# EAGLE design BeeBeeAte-ESP32-V4 (EAGLE 9.6.2)

## Sheet 1 of 4: Power Supply
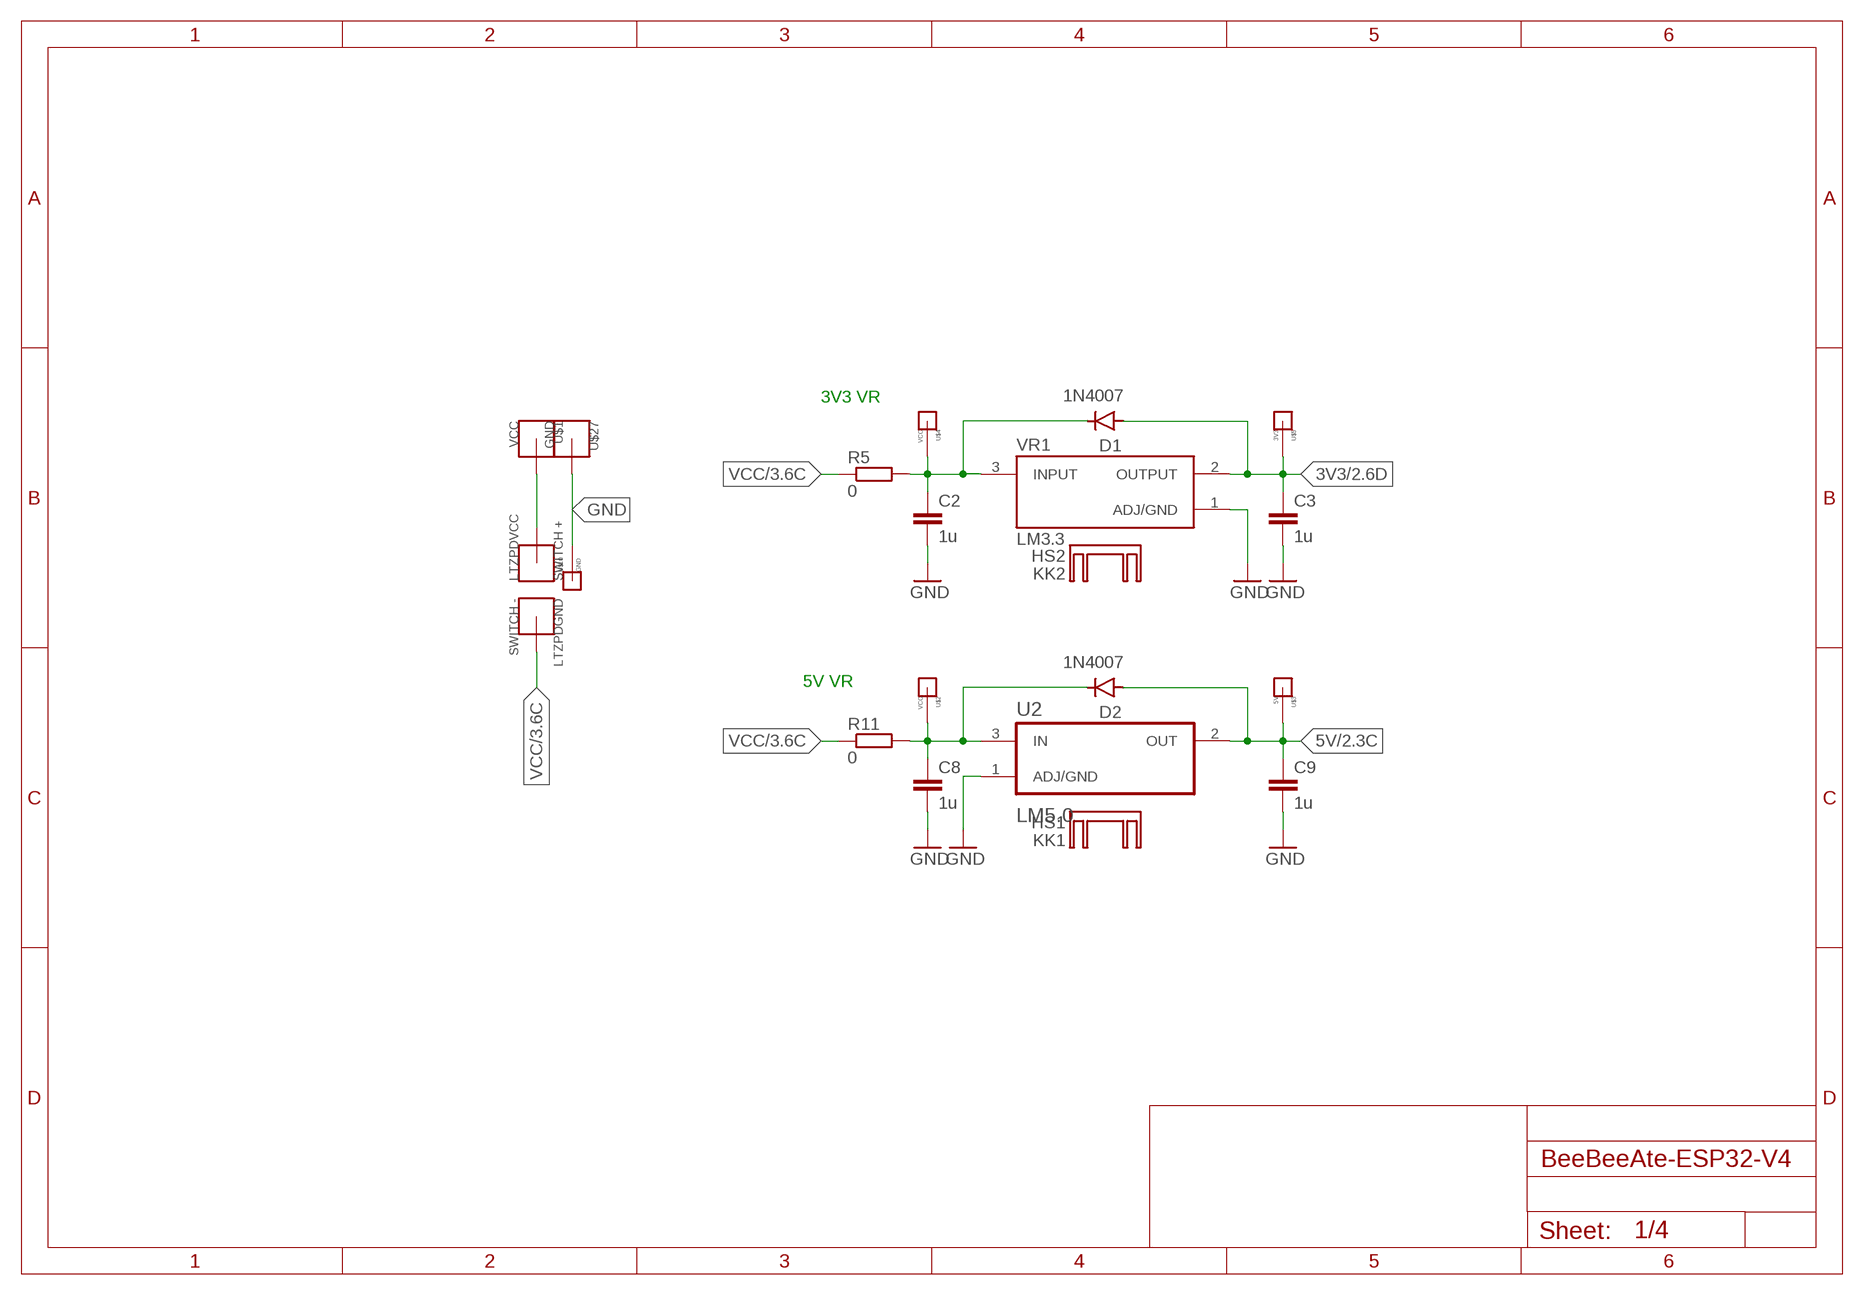
[diagram p0: schematic, sheet 1]

### Parts
C2  1u  C-EUC0805  [C0805]
C3  1u  C-EUC0805  [C0805]
C8  1u  C-EUC0805  [C0805]
C9  1u  C-EUC0805  [C0805]
D1  1N4007  [DO-41]
D2  1N4007  [DO-41]
KK1  HS1  SK95-2M3  [SK95-2M3]
KK2  HS2  SK95-2M3  [SK95-2M3]
LTZPDGND  SWITCH -  LITZENPAD  [LITZENPAD]
LTZPDVCC  SWITCH +  LITZENPAD  [LITZENPAD]
R5  0  R-EU_R0805  [R0805]
R11  0  R-EU_R0805  [R0805]
U2  LM5.0  LM1117T-5.0  [TO254P1054X470X1955-3]
U$1  VCC  LITZENPAD  [LITZENPAD]
U$2  VCC  MESSPAD  [MESSPAD]
U$3  5V  MESSPAD  [MESSPAD]
U$4  VCC  MESSPAD  [MESSPAD]
U$5  3V3  MESSPAD  [MESSPAD]
U$10  GND  MESSPAD  [MESSPAD]
U$27  GND  LITZENPAD  [LITZENPAD]
VR1  LM3.3  LM1117T-3.3/NOPB  [TO254P1054X470X1955-3]

### Nets
3V3: C3.1 D1.A U$5.MSP VR1.2(OUTPUT) ; also sheet 2,3,4
5V: C9.1 D2.A U2.2(OUT) U$3.MSP ; also sheet 2
GND: C2.2 C3.2 C8.2 C9.2 U2.1(ADJ/GND) U$10.MSP U$27.P$1 VR1.1(ADJ/GND) ; also sheet 2,3,4
N$4: C2.1 D1.C R5.2 U$4.MSP VR1.3(INPUT)
N$5: LTZPDVCC.P$1 U$1.P$1
N$8: C8.1 D2.C R11.2 U2.3(IN) U$2.MSP
VCC: LTZPDGND.P$1 R5.1 R11.1 ; also sheet 3

### Notes on the sheet
- 3V3 VR
- 5V VR

## Sheet 2 of 4: ESP32 und USB Modul
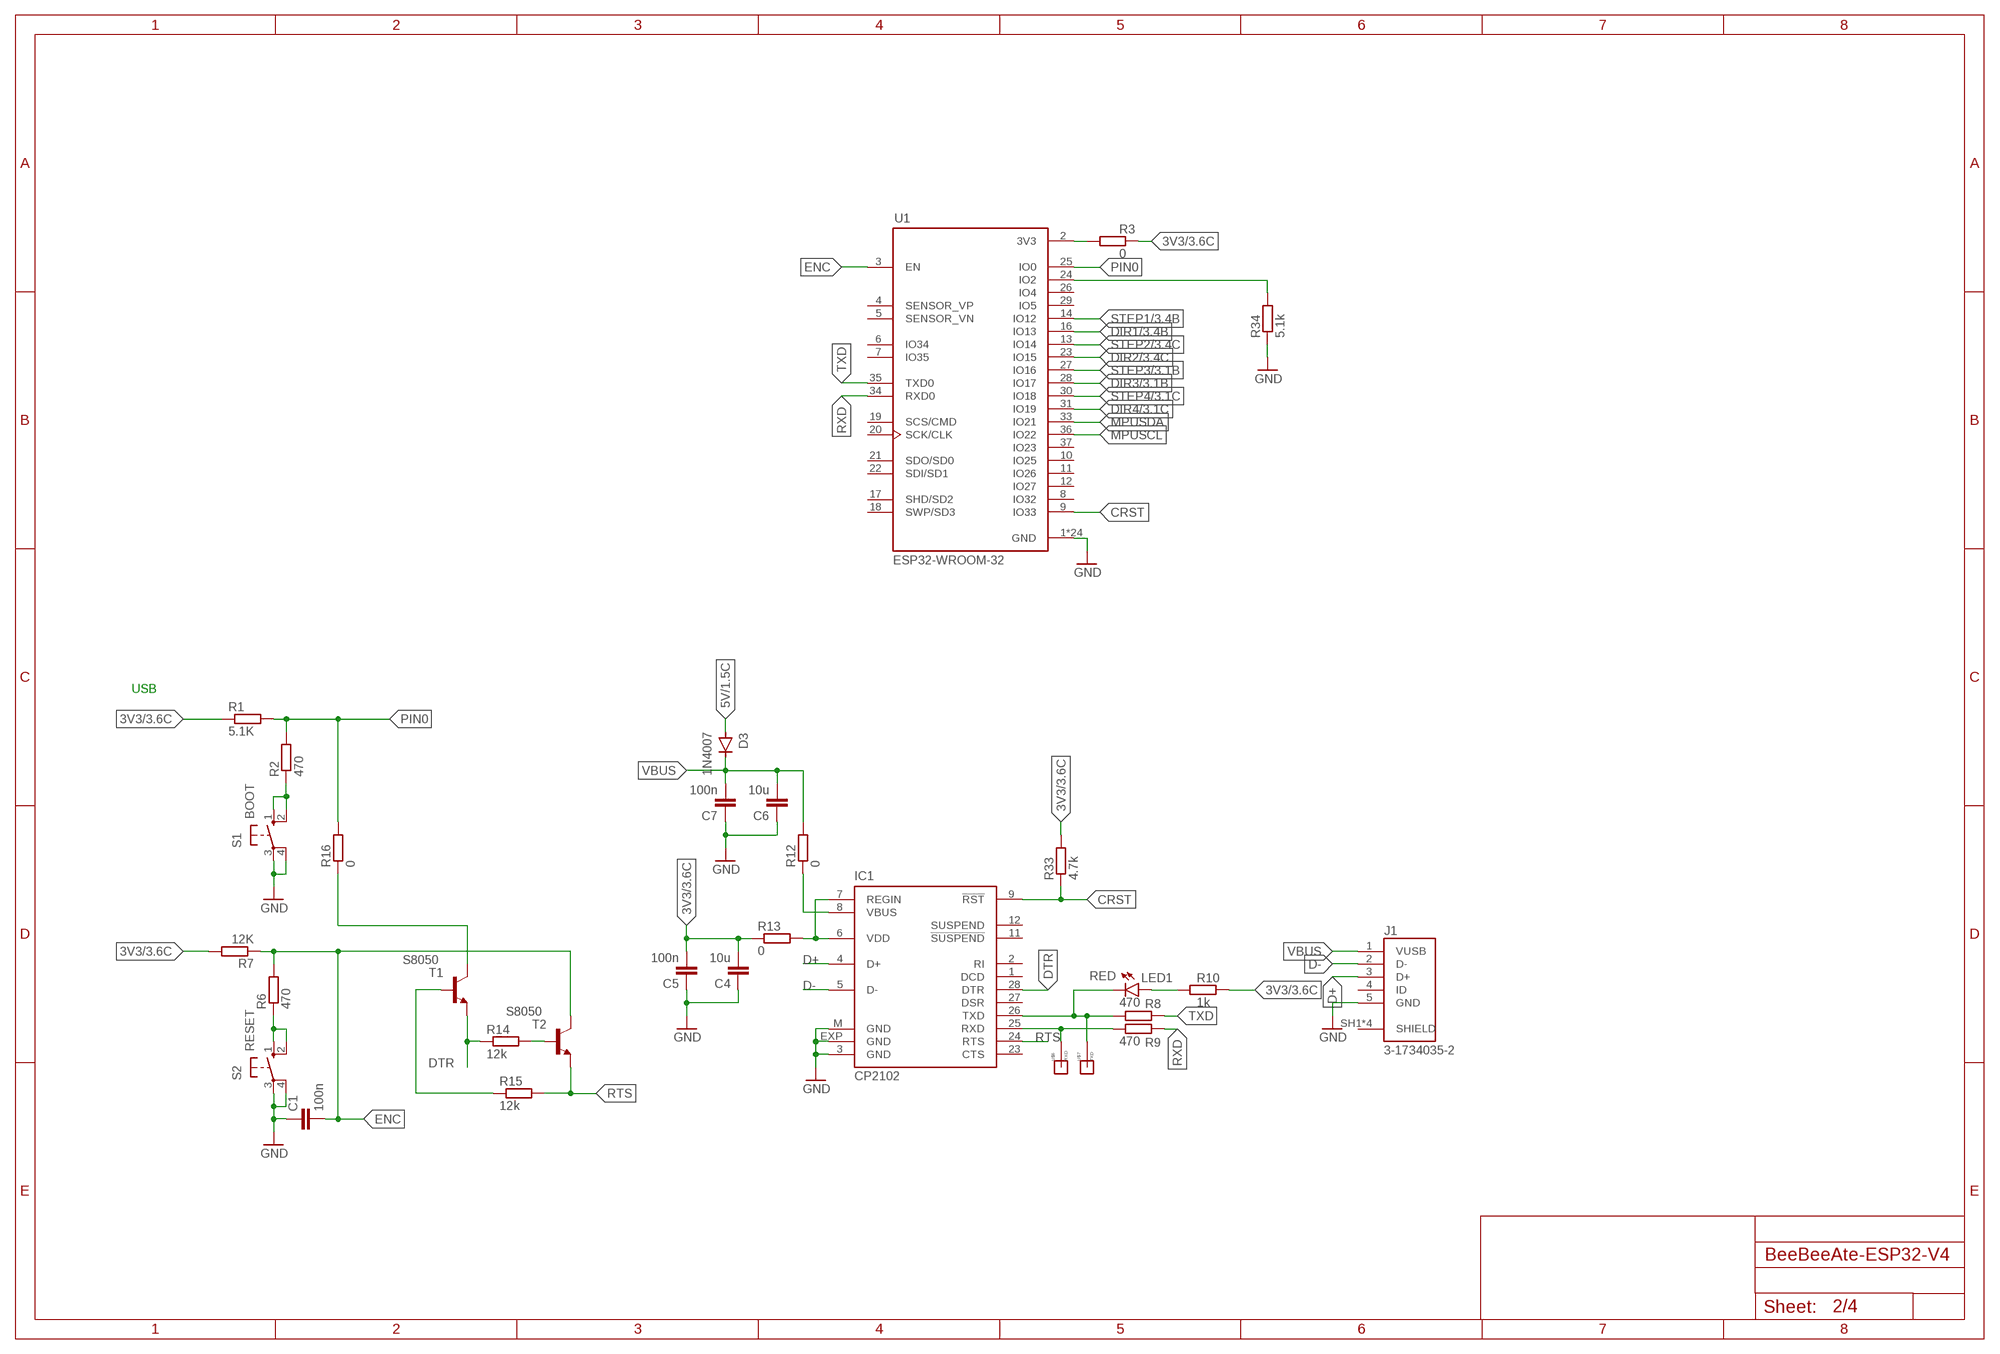
[diagram p1: schematic, sheet 2]

### Parts
C1  100n  C-EUC0805  [C0805]
C4  10u  C-EUC0805  [C0805]
C5  100n  C-EUC0805  [C0805]
C6  10u  C-EUC0805  [C0805]
C7  100n  C-EUC0805  [C0805]
D3  1N4007  [DO-41]
IC1  CP2102  [MLP28]
J1  3-1734035-2  [TE_3-1734035-2]
LED1  RED  LEDCHIP-LED0805  [CHIP-LED0805]
R1  5.1K  R-EU_R0805  [R0805]
R2  470  R-EU_R0805  [R0805]
R3  0  R-EU_R0805  [R0805]
R6  470  R-EU_R0805  [R0805]
R7  12K  R-EU_R0805  [R0805]
R8  470  R-EU_R0805  [R0805]
R9  470  R-EU_R0805  [R0805]
R10  1k  R-EU_R0805  [R0805]
R12  0  R-EU_R0805  [R0805]
R13  0  R-EU_R0805  [R0805]
R14  12k  R-EU_R0805  [R0805]
R15  12k  R-EU_R0805  [R0805]
R16  0  R-EU_R0805  [R0805]
R33  4.7k  R-EU_R0805  [R0805]
R34  5.1k  R-EU_R0805  [R0805]
S1  BOOT  10-XX  [B3F-10XX]
S2  RESET  10-XX  [B3F-10XX]
T1  S8050  BC808-NPN-SOT23-BEC  [SOT23-BEC]
T2  S8050  BC808-NPN-SOT23-BEC  [SOT23-BEC]
U1  ESP32-WROOM-32  [MODULE_ESP32-WROOM-32]
U$6  RXD  MESSPAD  [MESSPAD]
U$7  TXD  MESSPAD  [MESSPAD]

### Nets
3V3: C4.2 C5.2 R1.1 R3.2 R7.2 R10.2 R13.1 R33.2 ; also sheet 1,3,4
5V: D3.A ; also sheet 1
CRST: IC1.9(!RST) R33.1 U1.9(IO33)
D+: IC1.4(D+) J1.3(D+)
D-: IC1.5(D-) J1.2(D-)
DIR1: U1.16(IO13) ; also sheet 3
DIR2: U1.23(IO15) ; also sheet 3
DIR3: U1.28(IO17) ; also sheet 3
DIR4: U1.31(IO19) ; also sheet 3
DTR: IC1.28(DTR) R14.1 T1.E
ENC: C1.2 R6.2 R7.1 T2.C U1.3(EN)
GND: C1.1 C4.1 C5.1 C6.1 C7.1 IC1.3(GND) IC1.EXP(GND) IC1.M(GND) J1.5(GND) R34.1 S1.3(P) S1.4(P1) S2.3(P) S2.4(P1) U1.1(GND) U1.15(GND) U1.38(GND) U1.39_1(GND) U1.39_2(GND) U1.39_3(GND) U1.39_4(GND) U1.39_5(GND) U1.39_6(GND) U1.39_7(GND) U1.39_8(GND) U1.39_9(GND) U1.39_10(GND) U1.39_11(GND) U1.39_12(GND) U1.39_13(GND) U1.39_14(GND) U1.39_15(GND) U1.39_16(GND) U1.39_17(GND) U1.39_18(GND) U1.39_19(GND) U1.39_20(GND) U1.39_21(GND) ; also sheet 1,3,4
MPUSCL: U1.36(IO22) ; also sheet 4
MPUSDA: U1.33(IO21) ; also sheet 4
N$1: R2.1 S1.1(S) S1.2(S1)
N$2: R6.1 S2.1(S) S2.2(S1)
N$6: IC1.25(RXD) R9.1 U$6.MSP
N$7: LED1.A R10.1
N$9: IC1.26(TXD) LED1.C R8.1 U$7.MSP
N$10: IC1.6(VDD) IC1.7(REGIN) R13.2
N$11: IC1.8(VBUS) R12.1
N$12: R14.2 T2.B
N$14: R15.1 T1.B
N$25: R34.2 U1.24(IO2)
N$30: R3.1 U1.2(3V3)
PIN0: R1.2 R2.2 R16.2 U1.25(IO0)
PIN1: R16.1 T1.C
RTS: IC1.24(RTS) R15.2 T2.E
RXD: R9.2 U1.34(RXD0)
STEP1: U1.14(IO12) ; also sheet 3
STEP2: U1.13(IO14) ; also sheet 3
STEP3: U1.27(IO16) ; also sheet 3
STEP4: U1.30(IO18) ; also sheet 3
TXD: R8.2 U1.35(TXD0)
VBUS: C6.2 C7.2 D3.C J1.1(VUSB) R12.2
Unconnected: IC1.1(DCD) IC1.2(RI) IC1.11(!SUSPEND) IC1.12(SUSPEND) IC1.23(CTS) IC1.27(DSR) J1.4(ID) J1.SH1(SHIELD) J1.SH2(SHIELD) J1.SH3(SHIELD) J1.SH4(SHIELD) U1.4(SENSOR_VP) U1.5(SENSOR_VN) U1.6(IO34) U1.7(IO35) U1.8(IO32) U1.10(IO25) U1.11(IO26) U1.12(IO27) U1.17(SHD/SD2) U1.18(SWP/SD3) U1.19(SCS/CMD) U1.20(SCK/CLK) U1.21(SDO/SD0) U1.22(SDI/SD1) U1.26(IO4) U1.29(IO5) U1.37(IO23)

### Notes on the sheet
- USB

## Sheet 3 of 4: Treiber für Motoren
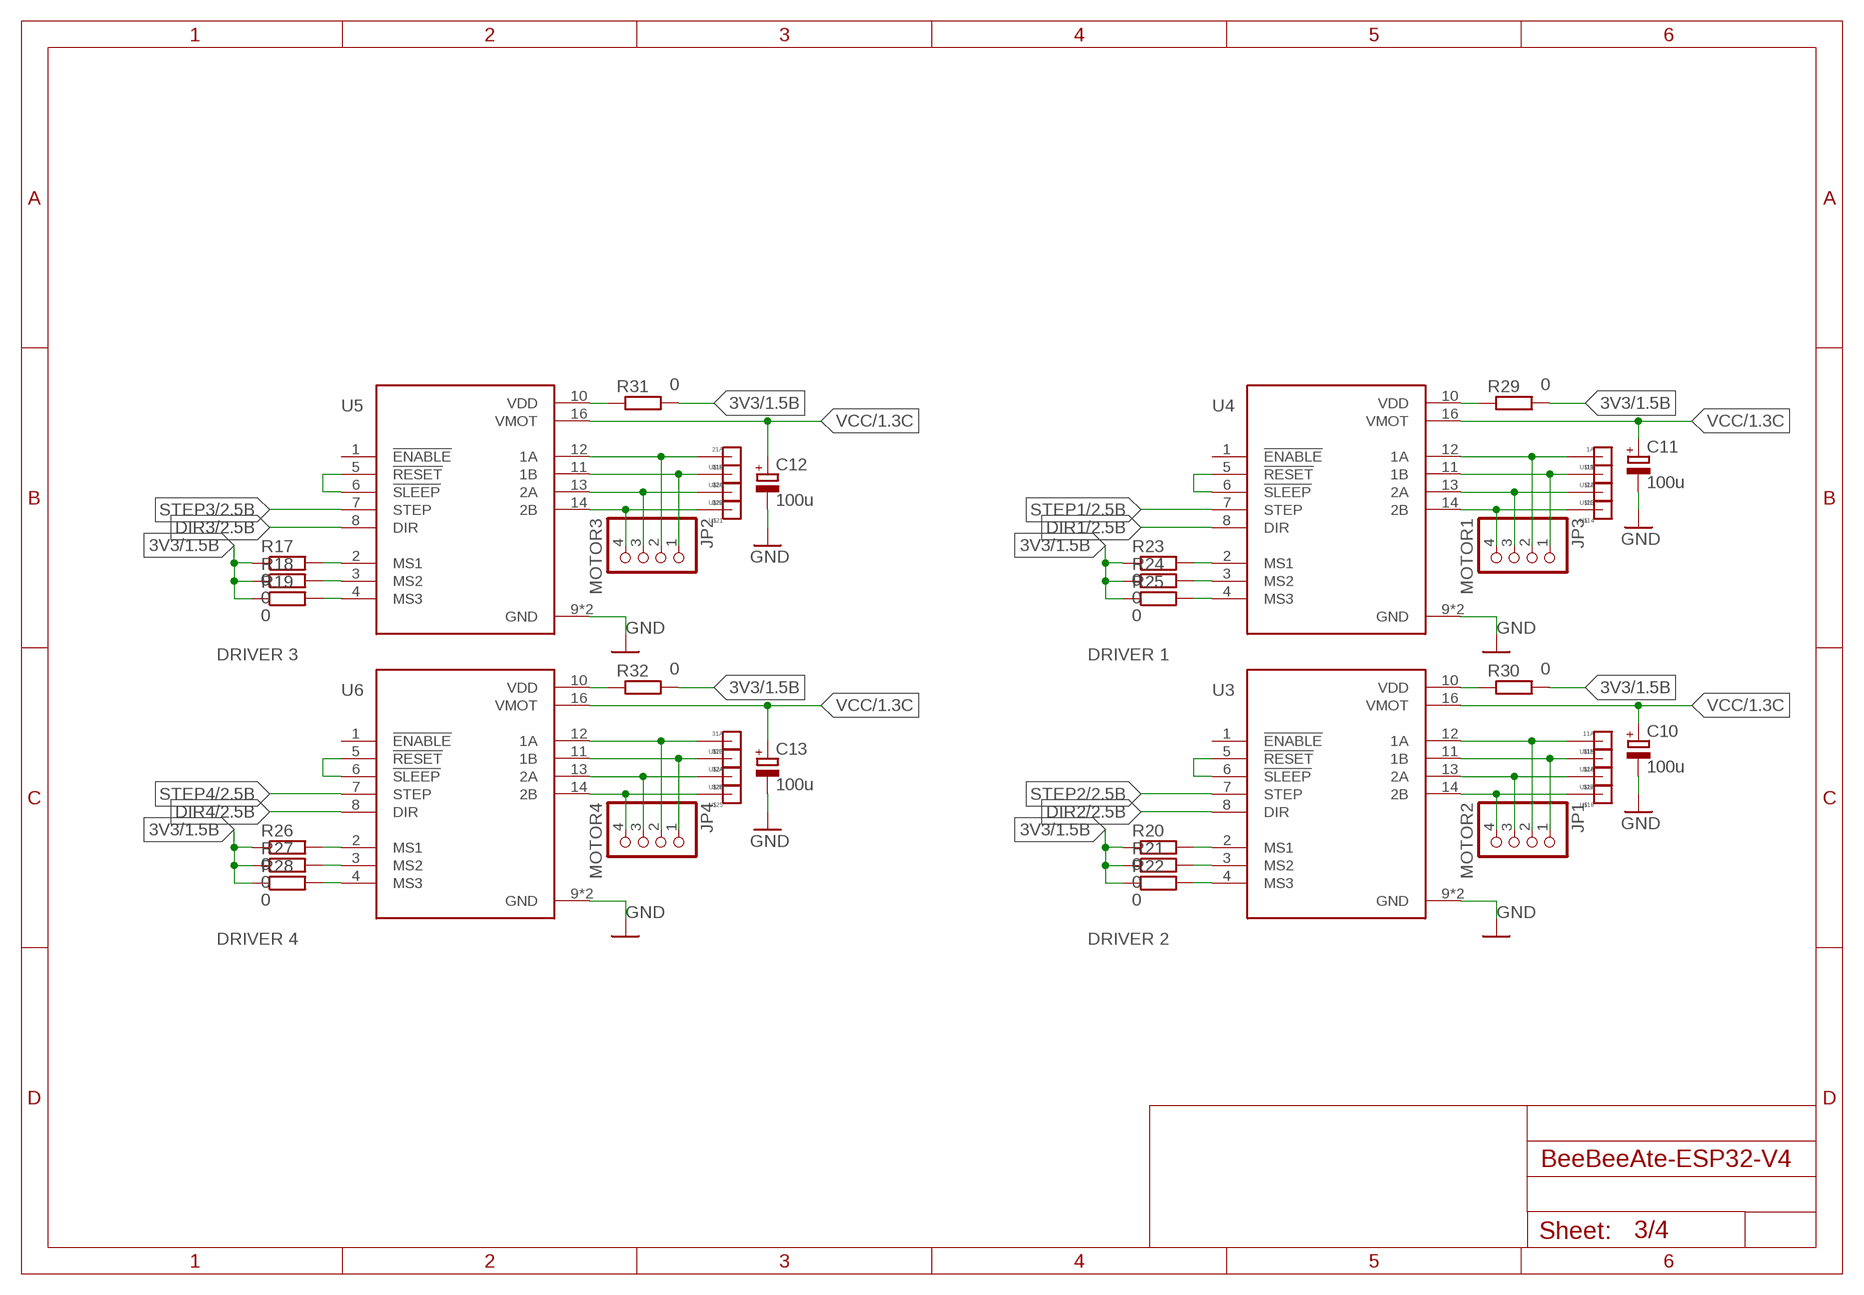
[diagram p2: schematic, sheet 3]

### Parts
C10  100u  CPOL-EU153CLV-0605  [153CLV-0605]
C11  100u  CPOL-EU153CLV-0605  [153CLV-0605]
C12  100u  CPOL-EU153CLV-0605  [153CLV-0605]
C13  100u  CPOL-EU153CLV-0605  [153CLV-0605]
JP1  MOTOR2  PINHD-1X4  [1X04]
JP2  MOTOR3  PINHD-1X4  [1X04]
JP3  MOTOR1  PINHD-1X4  [1X04]
JP4  MOTOR4  PINHD-1X4  [1X04]
R17  0  R-EU_R0805  [R0805]
R18  0  R-EU_R0805  [R0805]
R19  0  R-EU_R0805  [R0805]
R20  0  R-EU_R0805  [R0805]
R21  0  R-EU_R0805  [R0805]
R22  0  R-EU_R0805  [R0805]
R23  0  R-EU_R0805  [R0805]
R24  0  R-EU_R0805  [R0805]
R25  0  R-EU_R0805  [R0805]
R26  0  R-EU_R0805  [R0805]
R27  0  R-EU_R0805  [R0805]
R28  0  R-EU_R0805  [R0805]
R29  0  R-EU_R0805  [R0805]
R30  0  R-EU_R0805  [R0805]
R31  0  R-EU_R0805  [R0805]
R32  0  R-EU_R0805  [R0805]
U3  DRIVER 2  A4988_STEPPER_MOTOR_DRIVER_CARRIER  [MODULE_A4988_STEPPER_MOTOR_DRIVER_CARRIER]
U4  DRIVER 1  A4988_STEPPER_MOTOR_DRIVER_CARRIER  [MODULE_A4988_STEPPER_MOTOR_DRIVER_CARRIER]
U5  DRIVER 3  A4988_STEPPER_MOTOR_DRIVER_CARRIER  [MODULE_A4988_STEPPER_MOTOR_DRIVER_CARRIER]
U6  DRIVER 4  A4988_STEPPER_MOTOR_DRIVER_CARRIER  [MODULE_A4988_STEPPER_MOTOR_DRIVER_CARRIER]
U$11  1A  MESSPAD  [MESSPAD]
U$12  1B  MESSPAD  [MESSPAD]
U$13  2A  MESSPAD  [MESSPAD]
U$14  2B  MESSPAD  [MESSPAD]
U$15  11A  MESSPAD  [MESSPAD]
U$16  11B  MESSPAD  [MESSPAD]
U$17  12A  MESSPAD  [MESSPAD]
U$18  12B  MESSPAD  [MESSPAD]
U$19  21A  MESSPAD  [MESSPAD]
U$20  21B  MESSPAD  [MESSPAD]
U$21  22B  MESSPAD  [MESSPAD]
U$22  22A  MESSPAD  [MESSPAD]
U$23  31A  MESSPAD  [MESSPAD]
U$24  31B  MESSPAD  [MESSPAD]
U$25  32B  MESSPAD  [MESSPAD]
U$26  32A  MESSPAD  [MESSPAD]

### Nets
3V3: R17.1 R18.1 R19.1 R20.1 R21.1 R22.1 R23.1 R24.1 R25.1 R26.1 R27.1 R28.1 R29.2 R30.2 R31.2 R32.2 ; also sheet 1,2,4
DIR1: U4.8(DIR) ; also sheet 2
DIR2: U3.8(DIR) ; also sheet 2
DIR3: U5.8(DIR) ; also sheet 2
DIR4: U6.8(DIR) ; also sheet 2
GND: C10.- C11.- C12.- C13.- U3.9(GND) U3.15(GND) U4.9(GND) U4.15(GND) U5.9(GND) U5.15(GND) U6.9(GND) U6.15(GND) ; also sheet 1,2,4
N$13: R30.1 U3.10(VDD)
N$16: JP1.2 U3.12(1A) U$15.MSP
N$17: JP1.1 U3.11(1B) U$16.MSP
N$18: JP1.3 U3.13(2A) U$17.MSP
N$19: JP1.4 U3.14(2B) U$18.MSP
N$20: R20.2 U3.2(MS1)
N$21: R21.2 U3.3(MS2)
N$22: R22.2 U3.4(MS3)
N$23: U3.5(!RESET) U3.6(!SLEEP)
N$24: R29.1 U4.10(VDD)
N$26: JP2.2 U5.12(1A) U$19.MSP
N$27: JP2.1 U5.11(1B) U$20.MSP
N$28: JP2.3 U5.13(2A) U$22.MSP
N$29: JP2.4 U5.14(2B) U$21.MSP
N$32: JP3.2 U4.12(1A) U$11.MSP
N$33: JP3.1 U4.11(1B) U$12.MSP
N$34: JP3.3 U4.13(2A) U$13.MSP
N$35: R17.2 U5.2(MS1)
N$36: R18.2 U5.3(MS2)
N$37: R19.2 U5.4(MS3)
N$38: U5.5(!RESET) U5.6(!SLEEP)
N$39: R31.1 U5.10(VDD)
N$40: R32.1 U6.10(VDD)
N$41: JP3.4 U4.14(2B) U$14.MSP
N$42: R23.2 U4.2(MS1)
N$43: R24.2 U4.3(MS2)
N$44: R25.2 U4.4(MS3)
N$45: U4.5(!RESET) U4.6(!SLEEP)
N$49: JP4.2 U6.12(1A) U$23.MSP
N$50: JP4.1 U6.11(1B) U$24.MSP
N$51: JP4.3 U6.13(2A) U$26.MSP
N$52: JP4.4 U6.14(2B) U$25.MSP
N$53: R26.2 U6.2(MS1)
N$54: R27.2 U6.3(MS2)
N$55: R28.2 U6.4(MS3)
N$56: U6.5(!RESET) U6.6(!SLEEP)
STEP1: U4.7(STEP) ; also sheet 2
STEP2: U3.7(STEP) ; also sheet 2
STEP3: U5.7(STEP) ; also sheet 2
STEP4: U6.7(STEP) ; also sheet 2
VCC: C10.+ C11.+ C12.+ C13.+ U3.16(VMOT) U4.16(VMOT) U5.16(VMOT) U6.16(VMOT) ; also sheet 1
Unconnected: U3.1(!ENABLE) U4.1(!ENABLE) U5.1(!ENABLE) U6.1(!ENABLE)

## Sheet 4 of 4: MPU6050
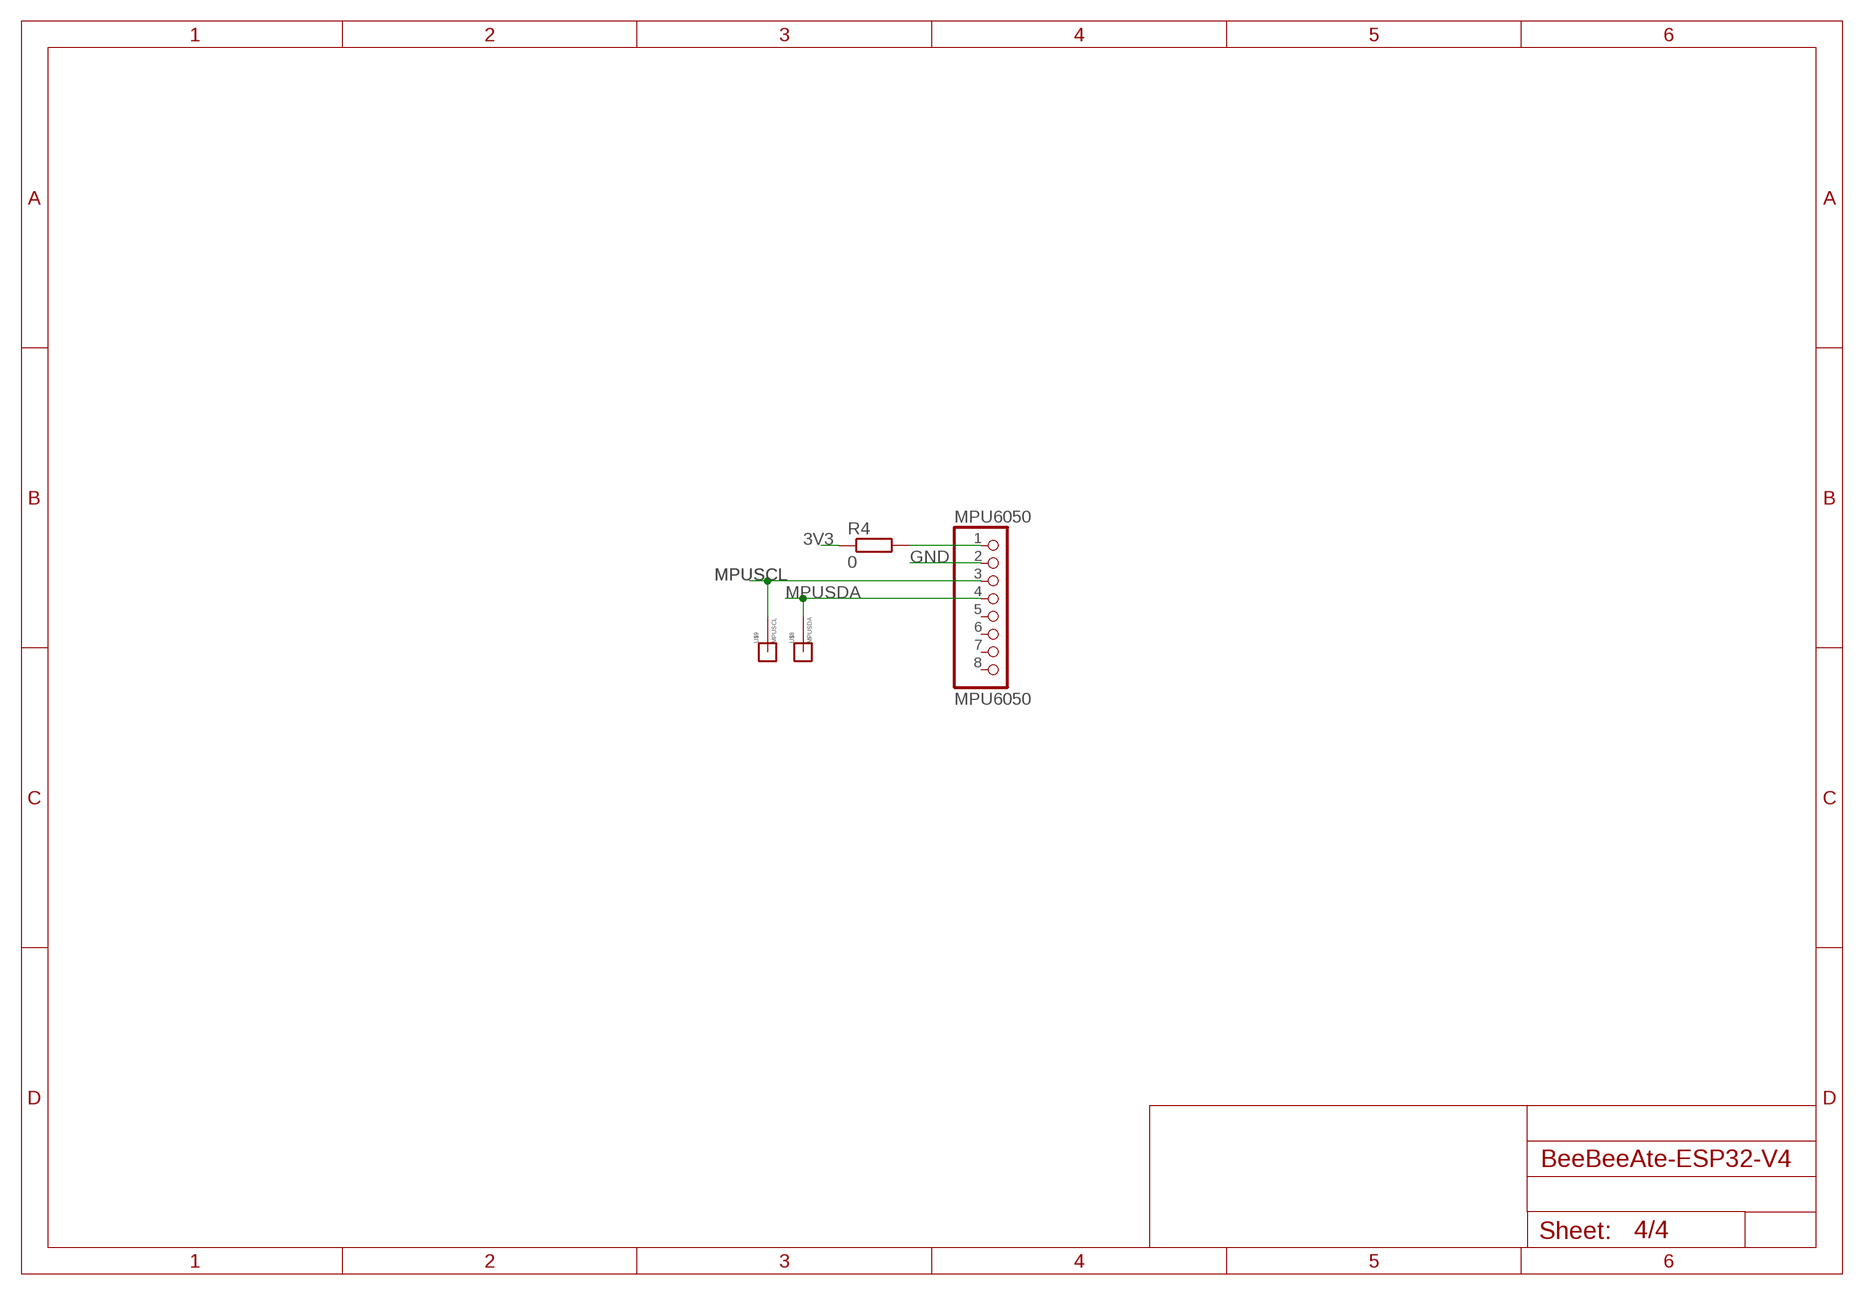
[diagram p3: schematic, sheet 4]

### Parts
MPU6050  MPU6050  PINHD-1X8  [1X08]
R4  0  R-EU_R0805  [R0805]
U$8  MPUSDA  MESSPAD  [MESSPAD]
U$9  MPUSCL  MESSPAD  [MESSPAD]

### Nets
3V3: R4.1 ; also sheet 1,2,3
GND: MPU6050.2 ; also sheet 1,2,3
MPUSCL: MPU6050.3 U$9.MSP ; also sheet 2
MPUSDA: MPU6050.4 U$8.MSP ; also sheet 2
N$3: MPU6050.1 R4.2
Unconnected: MPU6050.5 MPU6050.6 MPU6050.7 MPU6050.8

## Library data of the parts
C1-C9 = rcl:C-EU: CAPACITOR, European symbol; SPICEPREFIX: C
C10-C13 = rcl:CPOL-EU: POLARIZED CAPACITOR, European symbol; SPICEPREFIX: C
D1-D3 = Diodes:1N4007: DIODE GEN PURP 1KV 1A DO41 Manufacturer's datasheet <https://www.mccsemi.com/pdf/Products/1N4001-1N4007(DO-41).pdf>; CREATED_BY: PCBLayout.com; DIGIKEY_PART_NUMBER: 1N4007MSCT-ND; MANUFACTURER: Micro Commercial Co; MPN: 1N4007; PACKAGE: DO-41
IC1 = silabs:CP210*: Single-Chip USB to UART Bridge Source: www.silabs.com .. CP2101.pdf / cp2102.pdf; MF: FARNELL; MPN: CP2102-GM; OC_FARNELL: 9282130; OC_NEWARK: 30K5635
J1 = 3-1734035-2:3-1734035-2: USB Connectors MINI USB, R/A, SMT, MATTE TIN, W/O MYLAR Check prices <https://pricing.snapeda.com/parts/3-1734035-2/TE%20Connectivity/view-part?ref=eda>; AVAILABILITY: In Stock; COMMENT: 3-1734035-2; DESCRIPTION: USB Connectors MINI USB, R/A, SMT, MATTE TIN, W/O MYLAR; MF: TE Connectivity; MP: 3-1734035-2; PACKAGE: None; PRICE: None; PURCHASE-URL: https://pricing.snapeda.com/search/part/3-1734035-2/?ref=eda
JP1-JP4 = pinhead:PINHD-1X4: PIN HEADER
KK1 KK2 = heatsink:SK95-2M3: HEATSINK manufacturer Fischer/distributor Buerklin
LED1 = led:LED: LED OSRAM: - CHIPLED LG R971, LG N971, LY N971, LG Q971, LY Q971, LO R971, LY R971 LH N974, LH R974 LS Q976, LO Q976, LY Q976 LO Q996 - Hyper CHIPLED LW Q18S LB Q993, LB Q99A, LB R99A - SideLED LS A670, LO A670, LY A670, LG A670, LP A670 LB A673, LV A673, LT A673, LW A673 LH A674 LY A675 LS A676, LA A676, LO A676, LY A676, LW A676 LS A679, LY A679, LG A679 - Hyper Micro SIDELED® LS Y876, LA Y876, LO Y876, LY Y876 LT Y87S - SmartLED LW L88C, LW L88S LB L89C, LB L89S, LG L890 LS L89K, LO L89K, LY L89K LS L896, LA L896, LO L896, LY L896 - TOPLED LS T670, LO T670, LY T670, LG T670, LP T670 LSG T670, LSP T670, LSY T670, LOP T670, LYG T670 LG T671, LOG T671, LSG T671 LB T673, LV T673, LT T673, LW T673 LH T674 LS T676, LA T676, LO T676, LY T676, LB T676, LH T676, LSB T676, LW T676 LB T67C, LV T67C, LT T67C, LS T67K, LO T67K, LY T67K, LW E67C LS E67B, LA E67B, LO E67B, LY E67B, LB E67C, LV E67C, LT E67C LW T67C LS T679, LY T679, LG T679 LS T770, LO T770, LY T770, LG T770, LP T770 LB T773, LV T773, LT T773, LW T773 LH T774 LS E675, LA E675, LY E675, LS T675 LS T776, LA T776, LO T776, LY T776, LB T776 LHGB T686 LT T68C, LB T68C - Hyper Mini TOPLED® LB M676 - Mini TOPLED Santana® LG M470 LS M47K, LO M47K, LY M47K Source: http://www.osram.convergy.de LUXEON: - LUMILED® LXK2-PW12-R00, LXK2-PW12-S00, LXK2-PW14-U00, LXK2-PW14-V00 LXK2-PM12-R00, LXK2-PM12-S00, LXK2-PM14-U00 LXK2-PE12-Q00, LXK2-PE12-R00, LXK2-PE12-S00, LXK2-PE14-T00, LXK2-PE14-U00 LXK2-PB12-K00, LXK2-PB12-L00, LXK2-PB12-M00, LXK2-PB14-N00, LXK2-PB14-P00, LXK2-PB14-Q00 LXK2-PR12-L00, LXK2-PR12-M00, LXK2-PR14-Q00, LXK2-PR14-R00 LXK2-PD12-Q00, LXK2-PD12-R00, LXK2-PD12-S00 LXK2-PH12-R00, LXK2-PH12-S00 LXK2-PL12-P00, LXK2-PL12-Q00, LXK2-PL12-R00 Source: www.luxeon.com KINGBRIGHT: KA-3528ASYC Source: www.kingbright.com
LTZPDGND LTZPDVCC U$1 U$27 = 03lanfra-PADS:LITZENPAD
MPU6050 = pinhead:PINHD-1X8: PIN HEADER
R1-R34 = rcl:R-EU_: RESISTOR, European symbol; SPICEPREFIX: R
S1 S2 = switch-omron:10-XX: OMRON SWITCH; MPN: B3F-1000; OC_FARNELL: 176432; OC_NEWARK: 36M3542
T1 T2 = transistor:*-NPN-: NPN Transistror BF959 corrected 2008.03.06
U1 = ESP32-WROOM-32:ESP32-WROOM-32: Bluetooth, WiFi Transceiver Module 2.4GHz ~ 2.5GHz Surface Mount Check prices <https://pricing.snapeda.com/parts/ESP32-WROOM-32/Espressif%20Systems/view-part?ref=eda>; AVAILABILITY: In Stock; DESCRIPTION: Bluetooth, WiFi 802.11b/g/n, Bluetooth v4.2 +EDR, Class 1, 2 and 3 Transceiver Module 2.4GHz ~ 2.5GHz Antenna Not Included, U.FL Surface Mount; MF: Espressif Systems; MP: ESP32-WROOM-32; PACKAGE: Module Espressif Systems; PRICE: None; PURCHASE-URL: https://pricing.snapeda.com/search/part/ESP32-WROOM-32/?ref=eda
U2 = LM1117T-5.0:LM1117T-5.0: Check prices <https://pricing.snapeda.com/parts/LM1117T-5.0/NOPB/Texas%20Instruments/view-part?ref=eda>; AVAILABILITY: In Stock; DESCRIPTION: 800-mA 15-V linear voltage regulator 3-TO-220 0 to 125; MF: Texas Instruments; MP: LM1117T-5.0/NOPB; PACKAGE: TO-220-3 Texas Instruments; PRICE: None; PURCHASE-URL: https://pricing.snapeda.com/search/part/LM1117T-5.0/NOPB/?ref=eda
U3-U6 = A4988_STEPPER_MOTOR_DRIVER_CARRIER:A4988_STEPPER_MOTOR_DRIVER_CARRIER: Stepper motor controler; IC: A4988; 1A; Uin mot: 8÷35V Check prices <https://pricing.snapeda.com/parts/A4988%20STEPPER%20MOTOR%20DRIVER%20CARRIER/Pololu/view-part?ref=eda>; AVAILABILITY: Not in stock; DESCRIPTION: Stepper Motor Driver; MF: Pololu; MP: A4988 STEPPER MOTOR DRIVER CARRIER; PACKAGE: None; PRICE: None
U$2-U$26 = 03lanfra-PADS:MESSPAD
VR1 = LM1117T-3.3:LM1117T-3.3/NOPB: Check prices <https://pricing.snapeda.com/parts/LM1117T-3.3/NOPB/Texas%20Instruments/view-part?ref=eda>; AVAILABILITY: In Stock; DESCRIPTION: 800-mA 15-V linear voltage regulator 3-TO-220 0 to 125; MF: Texas Instruments; MP: LM1117T-3.3/NOPB; PACKAGE: TO-220-3 Texas Instruments; PRICE: None; PURCHASE-URL: https://pricing.snapeda.com/search/part/LM1117T-3.3/NOPB/?ref=eda

## Board
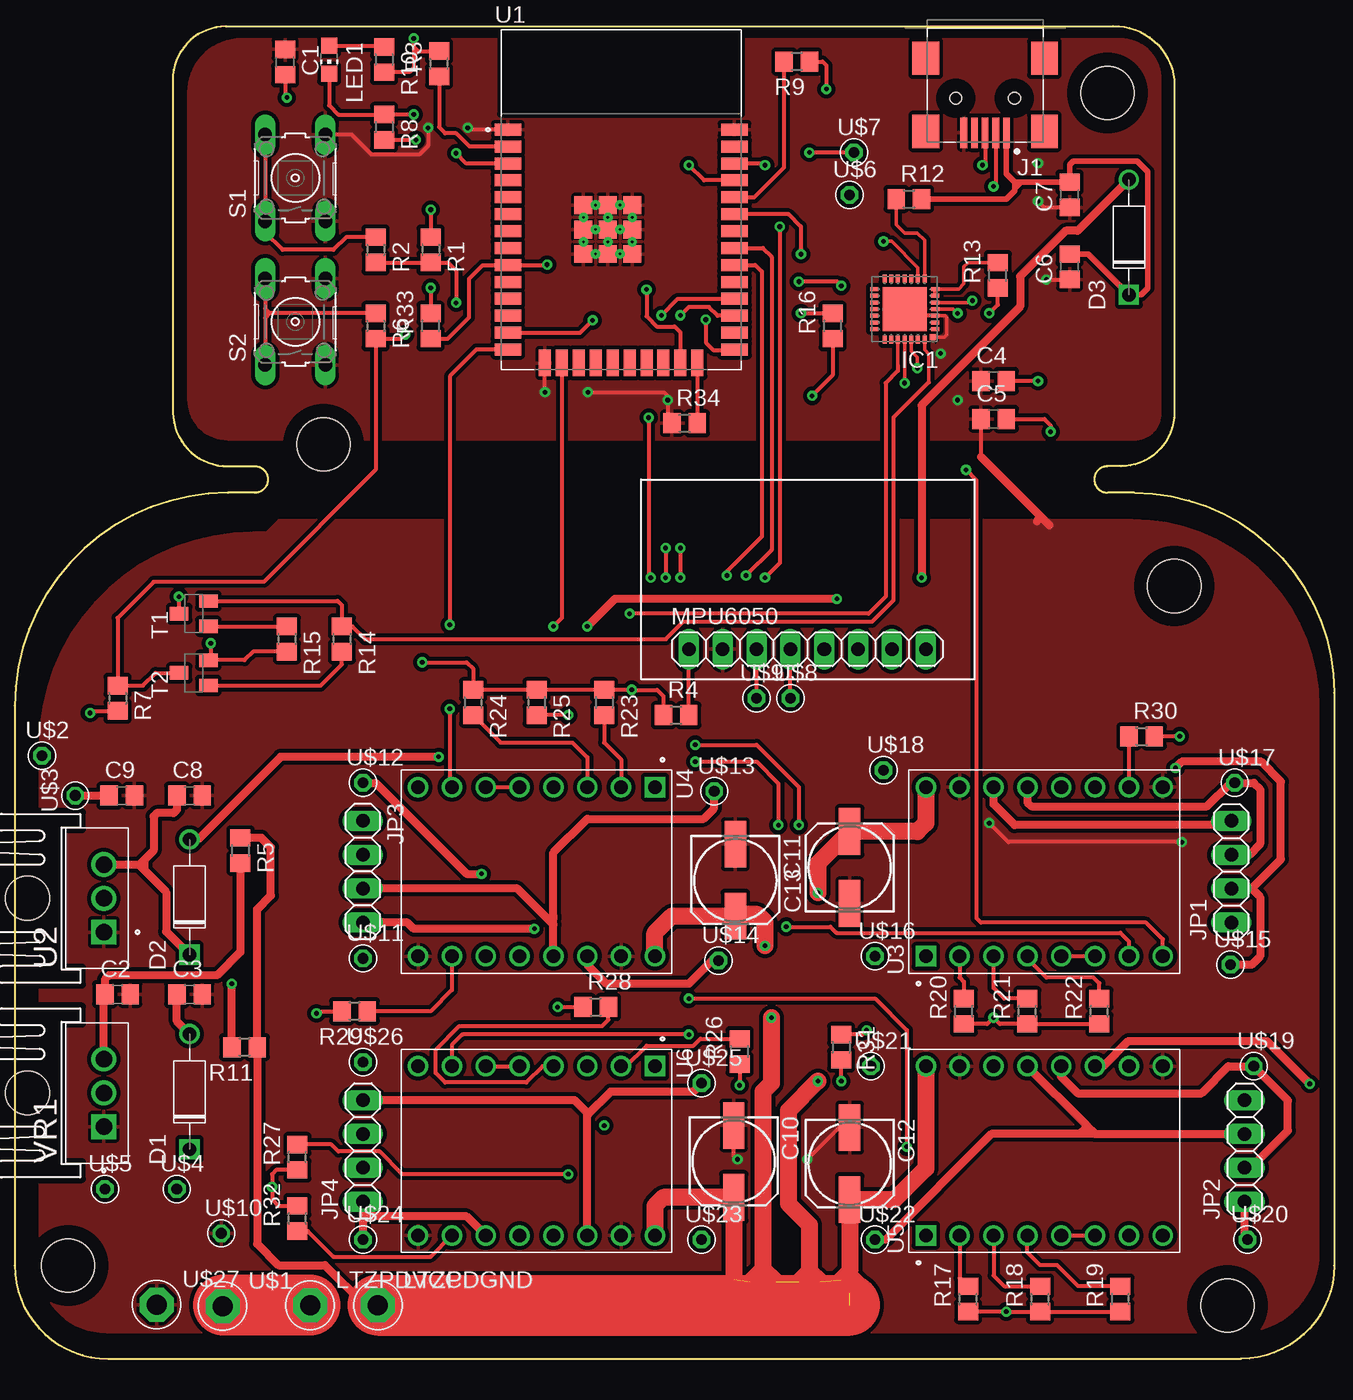
[diagram p4: board, top side]
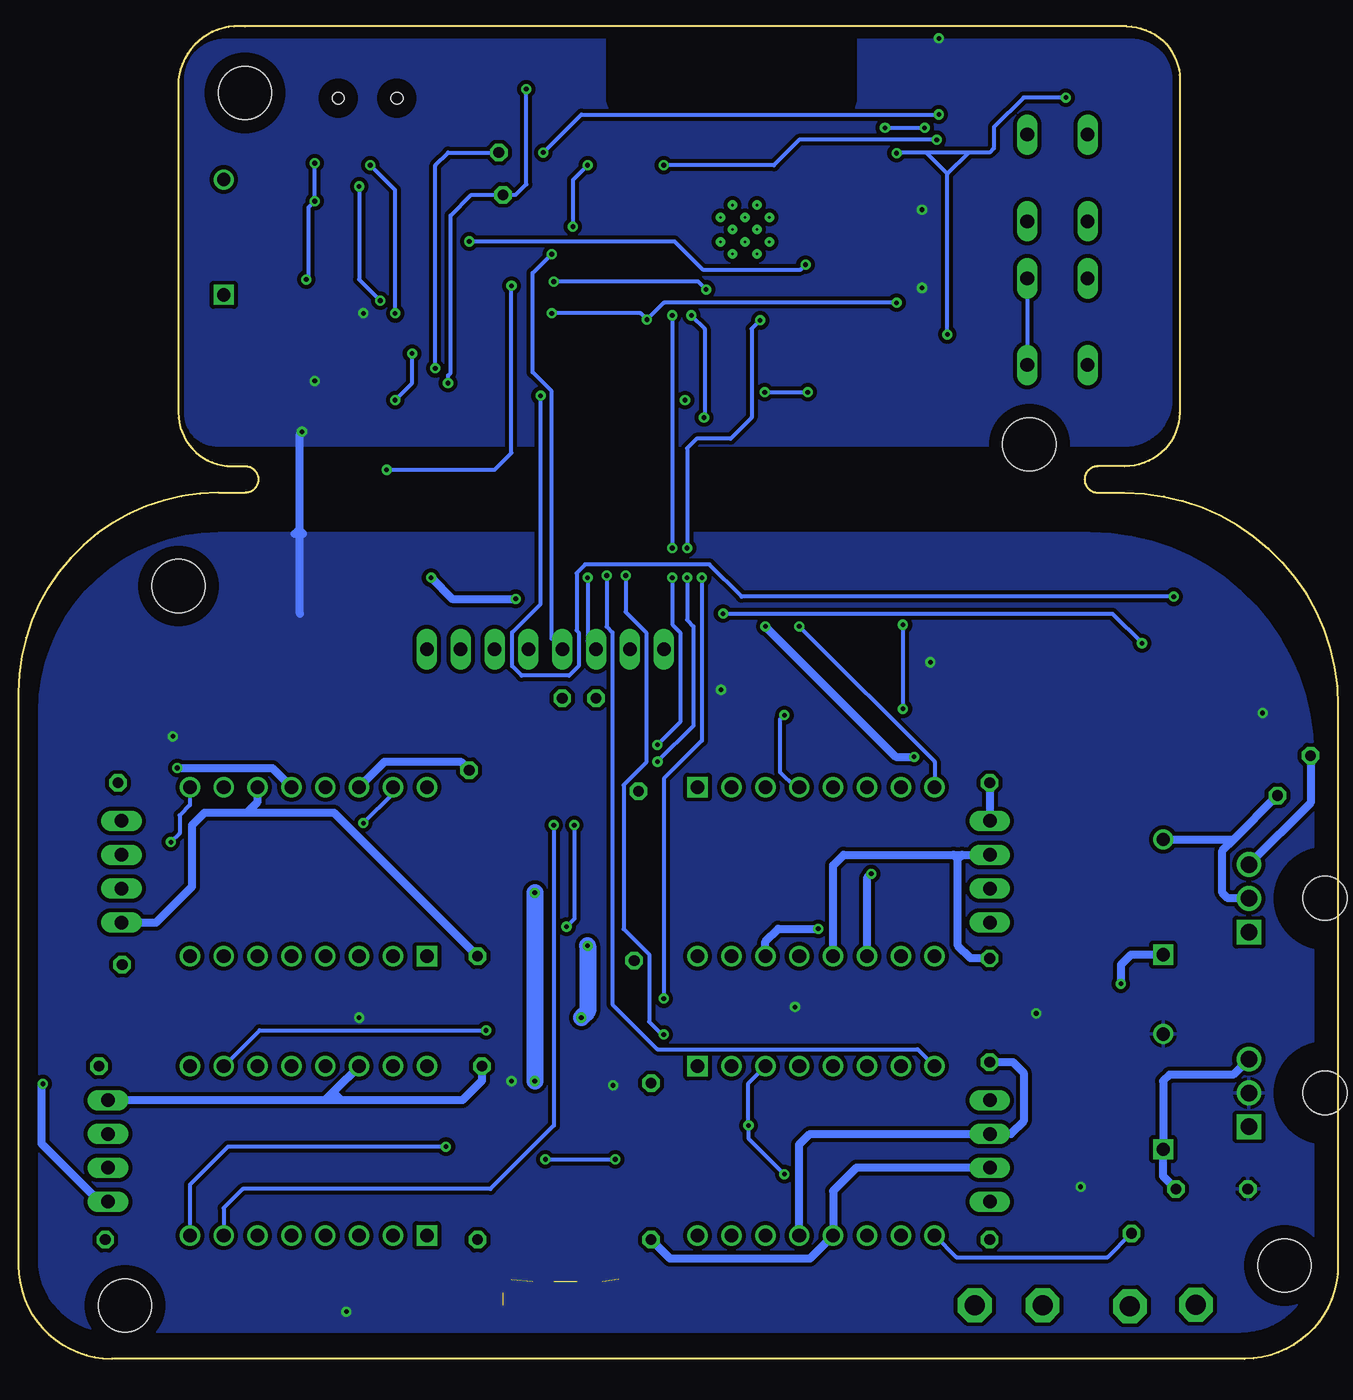
[diagram p5: board, bottom side, seen from below]

No outline drawn. Coordinates in mm, seen from the top.
Copper layers (1*16): Top 0.035mm / dielectric 1.5mm / Bottom 0.035mm
Design rules "default *": minimum track width 6mil, minimum drill 0.35mm, track to track 12mil, track to pad 12mil, pad to pad 12mil, via to via 12mil, smd to smd 12mil, copper to edge 40mil, drill to drill 12mil, minimum pad ring 10mil, minimum via ring 8mil, stop-mask expansion 4mil, vias tented up to drill 0mil, thermal gap 10mil
Holes 4 mm at 4.14,7 87.14,58 82.14,95 23.3,68.64 91.14,4
Milling: 22 lines

### Footprints (pad centres in the part's own frame; a part is rotated, then mirrored left to right if it is on the bottom)
C0805 = smd 1.3 x 1.5: 1 -0.95,0; 2 0.95,0
153CLV-0605 = smd 3.5 x 1.6: + 2.7,0; - -2.7,0
DO-41 = drill 1: A 4.325,0 | drill 1 square: C -4.325,0
MLP28 = smd 0.6 x 0.3: 1 -2.3,1.5; 2 -2.3,1; 3 -2.3,0.5; 4 -2.3,0; 5 -2.3,-0.5; 6 -2.3,-1; 7 -2.3,-1.5; 15 2.3,-1.5; 16 2.3,-1; 17 2.3,-0.5; 18 2.3,0; 19 2.3,0.5; 20 2.3,1; 21 2.3,1.5 | smd 0.3 x 0.6: 8 -1.5,-2.3; 9 -1,-2.3; 10 -0.5,-2.3; 11 0,-2.3; 12 0.5,-2.3; 13 1,-2.3; 14 1.5,-2.3; 22 1.5,2.3; 23 1,2.3; 24 0.5,2.3; 25 0,2.3; 26 -0.5,2.3; 27 -1,2.3; 28 -1.5,2.3 | smd 3.3 x 3.3: EXP 0,0 | smd 0.435 x 0.435: M -2.103,2.103
TE_3-1734035-2 = smd 0.5 x 2.3: 1 -1.6,2.6; 2 -0.8,2.6; 3 0,2.6; 4 0.8,2.6; 5 1.6,2.6 | smd 2 x 2.5: SH1 -4.45,2.5; SH2 4.45,2.5; SH3 -4.45,-3; SH4 4.45,-3 | hole 0.9: -2.2,0; 2.2,0
1X04 = drill 1.016 long: 1 -3.81,0; 2 -1.27,0; 3 1.27,0; 4 3.81,0
SK95-2M3 = hole 3.302: 0,2.54
CHIP-LED0805 = smd 1.2 x 1.2: A 0,-1.05; C 0,1.05
LITZENPAD = drill 1.5 pad 2.54 octagon: P$1 0,0
1X08 = drill 1.016 long: 1 -8.89,0; 2 -6.35,0; 3 -3.81,0; 4 -1.27,0; 5 1.27,0; 6 3.81,0; 7 6.35,0; 8 8.89,0
R0805 = smd 1.3 x 1.5: 1 -0.95,0; 2 0.95,0
B3F-10XX = drill 1.016 long: 1 -3.251,2.261; 2 3.251,2.261; 3 -3.251,-2.261; 4 3.251,-2.261
SOT23-BEC = smd 1 x 1.4: B -0.95,-1.1; C 0,1.1; E 0.95,-1.1
MODULE_ESP32-WROOM-32 = smd 2 x 0.9: 1 -8.5,5.26; 2 -8.5,3.99; 3 -8.5,2.72; 4 -8.5,1.45; 5 -8.5,0.18; 6 -8.5,-1.09; 7 -8.5,-2.36; 8 -8.5,-3.63; 9 -8.5,-4.9; 10 -8.5,-6.17; 11 -8.5,-7.44; 12 -8.5,-8.71; 13 -8.5,-9.98; 14 -8.5,-11.25; 25 8.5,-11.25; 26 8.5,-9.98; 27 8.5,-8.71; 28 8.5,-7.44; 29 8.5,-6.17; 30 8.5,-4.9; 31 8.5,-3.63; 32 8.5,-2.36; 33 8.5,-1.09; 34 8.5,0.18; 35 8.5,1.45; 36 8.5,2.72; 37 8.5,3.99; 38 8.5,5.26 | smd 0.9 x 2: 15 -5.715,-12.25; 16 -4.445,-12.25; 17 -3.175,-12.25; 18 -1.905,-12.25; 19 -0.635,-12.25; 20 0.635,-12.25; 21 1.905,-12.25; 22 3.175,-12.25; 23 4.445,-12.25; 24 5.715,-12.25 | smd 1.33 x 1.33: 39_1 -2.835,-0.405; 39_2 -1,-0.405; 39_3 0.835,-0.405; 39_4 -2.835,-2.24; 39_5 -1,-2.24; 39_6 0.835,-2.24; 39_7 -2.835,-4.075; 39_8 -1,-4.075; 39_9 0.835,-4.075 | drill 0.2 pad 0.3: 39_10 -1.917,-0.405; 39_11 -0.083,-0.405; 39_12 -2.835,-1.323; 39_13 -1,-1.323; 39_14 0.835,-1.323; 39_15 -1.917,-2.24; 39_16 -0.083,-2.24; 39_17 -2.835,-3.158; 39_18 -1,-3.158; 39_19 0.835,-3.158; 39_20 -1.917,-4.075; 39_21 -0.083,-4.075
TO254P1054X470X1955-3 = drill 1.24 square: 1 -2.54,0 | drill 1.24: 2 0,0; 3 2.54,0
MODULE_A4988_STEPPER_MOTOR_DRIVER_CARRIER = drill 1.02 square: 1 -6.35,8.89 | drill 1.02: 2 -6.35,6.35; 3 -6.35,3.81; 4 -6.35,1.27; 5 -6.35,-1.27; 6 -6.35,-3.81; 7 -6.35,-6.35; 8 -6.35,-8.89; 9 6.35,-8.89; 10 6.35,-6.35; 11 6.35,-3.81; 12 6.35,-1.27; 13 6.35,1.27; 14 6.35,3.81; 15 6.35,6.35; 16 6.35,8.89
MESSPAD = drill 0.8 octagon: MSP 0,0

### Placement (x,y rotation side)
C1  20.43,97.33 270 top
C2  7.86,27.35 0 top
C3  13.26,27.35 0 top
C4  73.58,73.39 0 top
C5  73.58,70.53 0 top
C6  79.3,81.96 90 top
C7  79.3,87.36 90 top
C8  13.26,42.27 0 top
C9  8.18,42.27 0 top
C10  54.09,14.81 270 top
C11  54.22,35.92 270 top
C12  62.79,14.65 270 top
C13  62.79,36.88 90 top
D1  13.26,20.05 90 top
D2  13.26,34.66 90 top
D3  83.74,84.19 90 top
IC1  66.92,78.79 180 top
J1  72.95,94.61 180 top
JP1  91.42,36.56 90 top
JP2  92.42,15.61 90 top
JP3  26.26,36.56 270 top
JP4  26.26,15.61 90 top
KK1  3.65,19.95 90 top
KK2  3.65,34.56 90 top
LED1  23.73,97.52 180 top
LTZPDGND  27.39,4.02 0 top
LTZPDVCC  22.31,4.02 0 top
MPU6050  59.61,53.26 0 top
R1  31.36,83.23 270 top
R2  27.23,83.23 270 top
R3  31.99,97.2 90 top
R4  49.77,48.31 0 top
R5  17.07,38.15 270 top
R6  27.23,77.52 270 top
R7  7.86,49.58 270 top
R8  27.86,92.44 270 top
R9  58.82,97.36 180 top
R10  27.86,97.52 270 top
R11  17.39,23.38 180 top
R12  67.23,87.04 0 top
R13  73.9,81.33 90 top
R14  24.69,54.02 270 top
R15  20.56,54.02 270 top
R16  61.52,77.52 90 top
R17  71.68,4.49 90 top
R18  77.08,4.49 90 top
R19  83.11,4.49 90 top
R20  71.36,26.08 90 top
R21  76.12,26.08 90 top
R22  81.52,26.08 90 top
R23  44.37,49.26 270 top
R24  34.53,49.26 270 top
R25  39.29,49.26 270 top
R26  54.53,23.07 90 top
R27  21.35,15.13 90 top
R28  43.74,26.4 0 top
R29  25.64,26.08 180 top
R30  84.69,46.72 0 top
R31  62.15,23.38 270 top
R32  21.35,10.53 90 top
R33  31.36,77.52 90 top
R34  50.41,70.22 0 top
S1  21.2,88.63 90 top
S2  21.2,77.83 90 top
T1  13.57,55.93 90 top
T2  13.57,51.48 90 top
U1  45.64,87 0 top
U2  6.83,34.56 90 top
U3  77.39,36.56 90 top
U4  39.29,36.56 270 top
U5  77.39,15.61 90 top
U6  39.29,15.61 270 top
U$1  15.75,3.95 0 top
U$2  2.19,45.27 0 top
U$3  4.68,42.27 90 top
U$4  12.3,12.75 0 top
U$5  6.91,12.75 0 top
U$6  62.79,87.36 0 top
U$7  63.1,90.53 0 top
U$8  58.34,49.58 0 top
U$9  55.8,49.58 0 top
U$10  15.64,9.41 0 top
U$11  26.27,30.05 0 top
U$12  26.27,43.23 0 top
U$13  52.63,42.59 0 top
U$14  52.95,29.89 0 top
U$15  91.36,29.57 0 top
U$16  64.69,30.21 0 top
U$17  91.68,43.23 0 top
U$18  65.33,44.18 0 top
U$19  93.11,21.95 0 top
U$20  92.63,8.94 0 top
U$21  64.38,21.95 0 top
U$22  64.69,8.94 0 top
U$23  51.67,8.94 0 top
U$24  26.27,8.94 0 top
U$25  51.67,20.68 0 top
U$26  26.27,22.27 0 top
U$27  10.79,4.07 0 top
VR1  6.83,19.95 90 top

### Tracks (layer width: path | path; a pad name or v marks a point on that pad's centre or on a via)
3V3  (via drill 0.35)
  Top 0.305: v30.09,99.11 30.09,98.47 | 30.09,98.47 30.09,97.84 | 30.09,97.84 30.09,96.89 29.77,96.57 R10.2 | 30.09,97.84 30.4,98.16 | R3.2 30.4,98.16 | 30.4,98.16 30.09,98.47 | v22.78,25.92 22.94,26.08 R29.2 | C3.1 | v5.8,48.47 5.96,48.62 R7.2 | v40.88,26.4 R28.1 | v62.15,20.84 R31.2 | R20.1 73.11,25.13 v73.58,25.61 74.06,25.13 R21.1 R22.1 | v87.55,46.72 R30.2 | R17.1 v74.53,3.54 v74.54,3.54 R18.1 R19.1 | R4.1 48.82,49.73 48.34,50.21 v46.44,50.21 R23.1 R25.1 R24.1 34.53,51.8 34.05,52.28 v30.72,52.28 | v31.36,80.38 R33.2 | v31.36,86.25 R1.1 | C5.2 77.39,70.53 77.87,70.06 v77.87,69.58 | v73.27,78.47 73.9,79.11 R13.1 | v76.92,73.39 C4.2 | R27.1 19.77,14.18 19.45,13.86 v19.45,12.91 19.45,11.95 19.93,11.47 R32.2 | R26.1 v54.53,20.53
  Top 0.61: D1.A 12.3,25.33 C3.1
  Bottom 0.305: 78.03,69.42 v77.87,69.58 | 77.79,61.91 77.63,61.91
  Bottom 0.61: 78.03,55.93 78.03,69.42 | 78.42,61.91 78.11,62.23 77.79,61.91
  pour Bottom (isolate 0.305): 18.73,62 arc90 2,45.27 2,7.46 arc90 7.46,2 92.14,2 arc90 97.6,7.46 97.6,48.54 arc90 84.14,62
  pour Bottom (isolate 0.305): 15.69,99.05 arc90 12.64,96 12.64,72 arc90 16.14,68.5 84.14,68.5 arc90 86.64,71 86.64,96 arc90 83.59,99.05 55.14,99.05 55.14,94.5 arc-90 53.85,93.21 37.44,93.21 arc-90 36.14,94.5 36.14,99.05
5V  (via drill 0.35)
  Top 0.61: U$3.MSP C9.1 | D3.A 79.89,84.66 78.99,84.66 75.58,81.25 75.58,78.97 68.19,71.58 v68.19,58.63 | v61.84,57.04 45.17,57.04 v43.1,54.98 | v31.95,45.18 20.1,45.18 13.9,38.98 D2.A
  Bottom 0.61: D2.A 7.98,38.98 | 7.98,38.98 U$3.MSP | U2.2 8.4,34.56 8.81,34.97 8.81,38.15 7.98,38.98 | v68.19,58.63 66.6,57.04 v61.84,57.04 | v43.1,54.98 33.31,45.18 v31.95,45.18
CRST  (via drill 0.35)
  Top 0.254: IC1.9 67.92,81.92 65.96,83.87 v65.33,83.87
  Top 0.305: R33.1 32.63,76.57 34.21,78.15 34.21,81.04 35.24,82.07 37.12,82.07 U1.9 40.06,82.09 v40.09,82.12
  Bottom 0.305: v65.33,83.87 49.93,83.87 47.82,81.76 40.45,81.76 v40.09,82.12
D+  (via drill 0.35)
  Top 0.254: IC1.4 70.57,78.79 v70.88,78.47
  Top 0.305: J1.3 72.95,89.78 v72.75,89.58
  Bottom 0.305: v70.88,78.47 70.88,87.71 v72.75,89.58
D-  (via drill 0.35)
  Top 0.254: 71.86,79.29 IC1.5
  Top 0.305: J1.2 73.75,88.16 v73.58,88 | 71.86,79.29 v72,79.42
  Bottom 0.305: v73.58,88 73.58,81.01 v72,79.42
DIR1  (via drill 0.35)
  Top 0.305: U1.16 41.2,55.61 v40.56,54.98
  Bottom 0.305: v40.56,54.98 30.4,44.81 U4.8
DIR2  (via drill 0.35)
  Top 0.305: U3.8 86.28,31.48 85.01,32.75 72.63,32.75 72.31,33.07 72.31,65.93 v71.52,66.72 | v62.15,80.53 61.84,80.85 v58.98,80.85 | U1.23 50.09,77.04 49.65,77.48 48.31,77.48 47.55,78.24 v47.55,80.26
  Bottom 0.305: v71.52,66.72 63.42,66.72 62.15,67.99 v62.15,80.53 | v47.55,80.26 48.14,80.85 v58.98,80.85
DIR3  (via drill 0.35)
  Top 0.305: v47.71,70.64 47.71,58.78 v47.87,58.63 | v50.72,27.04 64.69,27.04 67.07,24.65 v67.07,15.92 | v48.66,78.31 49.9,79.56 U1.28
  Bottom 0.305: v48.66,78.31 47.66,77.31 47.66,70.69 v47.71,70.64 | v47.87,58.63 47.87,46.4 50.72,43.55 v50.72,27.04 | v67.07,15.92 83.42,15.92 86.28,13.06 U5.8
DIR4  (via drill 0.35)
  Top 0.305: U1.31 56.28,83.36 56.94,82.71 56.94,60.72 v55.01,58.78
  Bottom 0.305: v55.01,58.78 55.01,54.95 54.58,54.53 54.58,26.61 51.2,23.23 31.67,23.23 U6.8
DTR
  Top 0.254: IC1.28 68.42,75.73 68.74,75.41 68.74,73.31 68.73,73.3
  Top 0.305: T1.E 24.37,56.88 24.69,56.56 R14.1 25.48,54.97 26.43,54.02 49,54.02 50.29,55.32 64.47,55.32 66.1,56.95 66.1,70.67 68.73,73.3
ENC  (via drill 0.35)
  Top 0.305: C1.2 20.43,94.79 v20.56,94.66 | v29.45,76.88 29.14,76.57 R6.2 27.23,66.72 18.81,58.31 10.56,58.31 7.86,55.61 R7.1 9.76,50.53 10.72,51.48 T2.C | U1.3 34.04,89.72 v33.26,90.49
  Bottom 0.305: v20.56,94.66 23.73,94.66 25.96,92.44 25.96,90.85 26.27,90.53 27.86,90.53 | v33.26,90.49 33.22,90.53 31.04,90.53 | 27.86,90.53 31.04,90.53 | v29.45,76.88 29.45,88.95 | 29.45,88.95 31.04,90.53 | 29.45,88.95 27.86,90.53
GND  (via drill 0.35)
  Top 0.254: IC1.3 69.95,78.29 70.09,78.15 70.09,76.88 69.89,76.69 IC1.M
  Top 0.305: R34.1 49.13,70.53 v49.13,71.96 49.13,72.25 48.88,72.5 43.2,72.5 v43.15,72.55 | v39.93,72.55 U1.15 | C12.- 61.99,17.35 v59.61,14.97 | v54.37,14.97 54.09,15.25 C10.- | IC1.3 67.42,78.29 IC1.EXP | v77.55,81.01 C6.1 | v87.71,38.78 74.69,38.78 v73.27,40.21 | C5.1 72.63,67.7 | v76.92,86.88 77.39,86.41 C7.1 | U1.1 34.27,92.25 v34.13,92.39 | v31.16,92.39 31.16,91.06 30.48,90.38 26.92,90.38 25.43,91.88 S1.4
  Top 0.61: 72.63,67.7 77.15,63.18 | 77.15,63.18 77.79,62.55 | 77.15,63.18 76.83,62.87
  Bottom 0.305: v76.92,89.74 v76.92,86.88 77.39,86.41 77.39,81.17 v77.55,81.01 | v70.88,71.96 69.61,73.23 v69.61,75.45 | v43.15,72.55 v39.93,72.55 | v59.61,14.97 v54.37,14.97 | S2.4 S2.3 | U3.9 86.28,41.55 87.05,40.78 87.05,39.44 v87.71,38.78 | v73.27,40.21 71.04,42.43 U3.15 | U6.9 28.77,7.62 17.43,7.62 U$10.MSP | v34.13,92.39 v31.16,92.39
  pour Top (isolate 0.305): 13.14,72 arc90 16.14,69 84.14,69 arc90 86.14,71 86.14,96 arc90 83.09,99.05 17.14,99.05 arc90 13.14,95.05
  pour Top (isolate 0.305): 19,62 18,62 arc90 2,46 2,7 arc90 7,2 92,2 arc90 98,8 98,48.95 arc90 84,62.95 19.95,62.95
MPUSCL  (via drill 0.35)
  Top 0.305: v56.44,89.58 56.3,89.72 U1.36 | v57.55,84.98 57.55,59.74 v56.44,58.63 | U$9.MSP MPU6050.3
  Bottom 0.305: v56.44,89.58 57.55,88.47 v57.55,84.98 | v56.44,58.63 56.44,53.9 MPU6050.3
MPUSDA  (via drill 0.35)
  Top 0.305: v59.14,82.92 59.14,84.98 58.21,85.91 U1.33 | U$8.MSP MPU6050.4
  Bottom 0.305: MPU6050.4 59.14,54.05 59.14,72.62 60.56,74.05 60.56,81.49 v59.14,82.92
N$1
  Top 0.305: R2.1 25,84.18 24.05,83.23 20.24,83.23 18.93,84.54 S1.1 S1.2
N$2
  Top 0.305: R6.1 19.29,78.47 | S2.2 18.93,78.83 | 19.29,78.47 18.93,78.83 | 19.29,78.47 18.93,78.11 | 18.93,78.11 S2.1 | 18.93,78.83 18.93,78.11
N$3
  Top 0.305: R4.2 MPU6050.1
N$4
  Top 0.305: 6.83,27.27 C2.1
  Top 0.61: C2.1 6.91,28.47 7.22,28.78 15.32,28.78 17.07,30.53 R5.2 | VR1.3 6.83,27.27
  Bottom 0.61: VR1.3 8,21.32 12.78,21.32 13.26,20.84 D1.C 13.26,13.7 U$4.MSP
N$5
  Top 4.064: 15.81,4.02 U$1.P$1
  Top 4.572: LTZPDVCC.P$1 15.81,4.02
N$6  (via drill 0.35)
  Top 0.254: IC1.25 v66.92,73.23
  Top 0.305: R9.1 60.75,97.36 61.04,97.07 v61.04,95.3
  Bottom 0.305: v66.92,73.23 66.92,73.8 66.72,74 66.72,85.81 65.17,87.36 U$6.MSP 61.84,87.36 61.04,88.15 v61.04,95.3
N$7
  Top 0.305: LED1.A 27.76,98.57 R10.1
N$8  (via drill 0.35)
  Top 0.305: 9.45,37.1 9.51,37.1 | v16.43,28.14 v16.43,28.15
  Top 0.61: U2.3 9.45,37.1 9.84,36.7 | 9.51,37.1 9.84,37.43 | 9.84,37.43 10.56,38.15 10.56,40.72 10.79,40.96 12.06,40.96 12.31,41.2 C8.1 | 9.84,36.7 11.51,35.04 11.51,32.08 D2.C | R11.2 v16.43,28.14 | 9.84,37.43 9.84,36.7
  Bottom 0.61: v16.43,28.15 16.43,29.57 15.68,30.33 D2.C | U$2.MSP 2.19,41.73 U2.3
N$9  (via drill 0.35)
  Top 0.254: IC1.26 67.42,75.62 67.87,75.17 v67.87,74.34
  Top 0.305: LED1.C 23.73,94.09 24.43,93.39 R8.1 v30.09,93.39 | U$7.MSP v59.77,90.53
  Bottom 0.305: v67.87,74.34 67.87,89.58 66.92,90.53 U$7.MSP | v30.09,93.39 56.91,93.39 v59.77,90.53
N$10
  Top 0.254: IC1.7 70.95,80.29 71.36,80.69 71.36,81.96 71.68,82.28 R13.2
  Top 0.305: R13.2 | IC1.6 IC1.7
N$11
  Top 0.254: IC1.8 68.42,83.95 67.87,84.5 66.92,84.5 66.28,85.14 R12.1
  Top 0.305: R12.1
N$12
  Top 0.305: T2.B 23.1,50.53 24.69,52.12 R14.2
N$13
  Top 0.305: R30.1 U3.10
N$14
  Top 0.305: T1.B R15.1
N$16  (via drill 0.35)
  Top 0.61: JP1.2 92.95,35.29 | 92.95,35.29 93.58,34.66 93.58,30.21 92.95,29.57 U$15.MSP | v87.23,44.34 87.71,44.81 93.65,44.81 95.15,43.32 95.15,37.49 92.95,35.29
  Bottom 0.61: v87.23,44.34 80.09,44.34 U3.12
N$17
  Bottom 0.61: JP1.1 88.82,32.75 86.12,35.45 86.12,40.05 85.17,41.01 82,41.01 | 82,41.01 81.68,41.32 | 81.68,41.32 81.2,41.8 U3.11 | 82,41.01 81.36,41.01 | 81.36,41.01 75.49,41.01 U$16.MSP | 81.68,41.32 81.36,41.01
N$18
  Top 0.305: 91.36,43.23 U$17.MSP
  Top 0.61: U3.13 76.12,41.77 76.44,41.46 89.59,41.46 91.36,43.23 | U$17.MSP 93.11,43.23 93.58,42.75 93.58,38.62 92.79,37.83 JP1.3
N$19
  Top 0.61: JP1.4 91.11,40.05 75.17,40.05 73.58,41.64 U3.14
  Bottom 0.61: U3.14 71.68,44.81 65.96,44.81 U$18.MSP
N$20
  Top 0.305: U3.2 71.04,28.62 71.36,28.3 R20.2
N$21
  Top 0.305: R21.2 74.38,27.03 73.58,27.83 U3.3
N$22
  Top 0.305: U3.4 76.12,30.05 77.55,28.62 81.07,28.62 81.52,28.18 R22.2
N$23
  Top 0.305: U3.6 U3.5
N$24
  Top 0.305: U4.10 32.94,27.67 31.36,26.08 R29.1
N$25
  Top 0.305: U1.24 R34.2
N$26
  Top 0.61: U5.12 78.66,21.16 79.89,19.94 89.19,19.94 91.2,21.95 U$19.MSP 95.67,19.39 95.67,17.11 92.9,14.34 JP2.2
N$27  (via drill 0.35)
  Top 0.61: U$20.MSP 92.42,9.15 JP2.1 | U5.11 81.8,21.95 83.7,23.85 94.1,23.85 v97.31,20.64
  Bottom 0.61: JP2.1 93.06,11.79 97.42,16.16 97.42,20.53 v97.31,20.64
N$28
  Top 0.406: 79.85,16.83 80.49,17.46
  Top 0.61: 81.2,16.88 JP2.3 | 81.2,16.88 73.42,16.88 65.49,8.94 U$22.MSP | 80.49,17.59 80.49,17.46 80.61,17.46 | 80.49,17.59 U5.13 | 81.2,16.88 80.61,17.46 | 80.61,17.46 80.49,17.59
N$29
  Bottom 0.406: 74.77,19.37 75.41,20
  Bottom 0.61: 76.04,19.41 65.83,19.41 64.38,20.87 U$21.MSP | 76.04,19.41 JP2.4 | 75.41,20 75.41,20.13 | U5.14 75.41,20.13 | 75.41,20.13 76.04,19.5 76.04,19.41
N$30
  Top 0.305: R3.1 31.99,92.44 32.45,91.98 33.27,91.98 34.27,90.98 U1.2
N$32
  Bottom 0.61: U4.12 38.02,37.04 37.23,37.83 28.97,37.83 | 28.97,37.83 28.34,37.83 | 28.34,37.83 JP3.2 | U$11.MSP 27.7,30.05 28.66,31 28.66,37.51 | 28.66,37.51 28.34,37.83 | 28.66,37.51 28.97,37.83
N$33  (via drill 0.35)
  Top 0.61: U$12.MSP 27.23,43.23 34.05,36.4 v35.16,36.4
  Bottom 0.305: 26.27,40.38 JP3.1
  Bottom 0.61: U$12.MSP 26.27,40.38 | v35.16,36.4 35.48,36.08 U4.11
N$34
  Top 0.305: 40.4,33.07 40.56,33.07
  Top 0.61: U4.13 40.56,32.59 | JP3.3 37.86,35.29 40.09,33.07 | 40.56,32.59 40.09,33.07 | 40.56,32.59 40.56,33.07 40.56,33.23 | 40.56,33.23 40.56,37.99 43.1,40.53 51.83,40.53 52.63,41.32 U$13.MSP | 40.09,33.07 40.4,33.07 40.56,33.23
N$35
  Top 0.305: U5.2 71.04,6.08 R17.2
N$36
  Top 0.305: U5.3 73.58,6.24 74.38,5.44 R18.2
N$37
  Top 0.305: R19.2 79.94,5.44 78.34,7.03 77.08,7.03 76.12,7.99 U5.4
N$38
  Top 0.305: U5.5 U5.6
N$39  (via drill 0.35)
  Top 0.305: v64.06,24.65 63.74,24.33 R31.1
  Bottom 0.305: U5.10 81.04,24.65 v64.06,24.65
N$40
  Top 0.305: R32.1 22.14,9.57 24.05,7.67 31.36,7.67 U6.10
N$41  (via drill 0.35)
  Top 0.61: U$14.MSP 52.47,29.89 50.72,28.15 44.53,28.15 43.1,29.57 U4.14 | v39.13,32.27 30.09,32.27 29.61,32.75 JP3.4
  Bottom 0.61: U4.14 43.1,31.32 42.15,32.27 v39.13,32.27
N$42
  Top 0.305: R23.2 44.37,46.24 45.64,44.97 U4.2
N$43
  Top 0.305: R24.2 36.6,46.24 41.99,46.24 43.1,45.13 U4.3
N$44  (via drill 0.35)
  Top 0.305: v41.67,48.31 R25.2
  Bottom 0.305: U4.4 40.88,42.91 41.99,44.02 41.99,47.99 v41.67,48.31
N$45
  Top 0.305: U4.6 U4.5
N$49
  Bottom 0.61: U$23.MSP 50.25,7.51 39.77,7.51 U6.12 38.02,12.59 36.28,14.34 JP4.2
N$50
  Top 0.305: 26.27,11.78 JP4.1 | 26.59,10.68 26.27,10.68
  Top 0.61: U$24.MSP 26.27,10.37 | 26.27,10.37 26.27,10.68 26.27,11 | 26.27,11 26.27,11.78 | U6.11 34.05,10.68 26.59,10.68 | 26.59,10.68 26.27,10.37 | 26.59,10.68 26.27,11
N$51
  Bottom 0.61: U6.13 40.56,16.08 39.77,16.88 JP4.3 24.69,16.88 23.73,17.83 23.73,21.48 24.53,22.27 U$26.MSP
N$52
  Top 0.305: 43.1,18.3 43.18,18.38
  Top 0.61: U6.14 43.1,18.3 | U$25.MSP 51.04,20.05 44.85,20.05 43.18,18.38 42.15,19.41 JP4.4
N$53
  Top 0.305: U6.2 46.01,21.95 47.55,23.5 51.07,23.5 51.58,24.02 R26.2
N$54  (via drill 0.35)
  Top 0.305: v41.67,13.86 29.23,13.86 27.53,15.55 24.42,15.55 23.89,16.08 R27.2
  Bottom 0.305: U6.3 44.37,20.68 v44.37,17.51 44.37,16.56 v41.67,13.86
N$55
  Top 0.305: U6.4 39.75,21.95 38.53,20.73 32.44,20.73 31.72,21.45 31.72,23.18 33.51,24.97 44.21,24.97 44.69,25.45 R28.2
N$56
  Top 0.305: U6.6 U6.5
PIN0  (via drill 0.35)
  Top 0.305: R2.2 R1.2 32.65,82.28 33.26,81.67 v33.26,79.26 | v59.14,78.47 R16.2 | U1.25 54.12,75.72 52.55,75.72 51.99,76.28 v51.99,77.99
  Bottom 0.305: v33.26,79.26 50.72,79.26 v51.99,77.99 52.47,78.47 v59.14,78.47
PIN1  (via drill 0.35)
  Top 0.305: T1.C 12.47,57.19 v12.46,57.2 | R16.1 61.52,73.83 v59.97,72.28
  Bottom 0.305: v12.46,57.2 44.89,57.2 47.31,59.62 56.62,59.62 57.27,58.97 57.27,54.68 57.12,54.53 57.12,51.99 57.84,51.28 61.39,51.28 62.1,51.99 62.1,54.53 59.97,56.66 v59.97,72.28
RTS  (via drill 0.35)
  Top 0.254: IC1.24 66.42,74.51
  Top 0.305: v14.85,53.7 14.85,52.6 T2.E 17.38,52.43 18.02,53.07 R15.2 | v46.28,55.93 64.22,55.93 65.49,57.2 65.49,73.23 66.42,74.16 66.42,74.51
  Bottom 0.305: v46.28,55.93 17.07,55.93 v14.85,53.7
RXD
  Top 0.305: U1.34 55.62,87.17 57.87,89.43 R9.2
STEP1  (via drill 0.35)
  Top 0.305: v32.78,48.78 32.78,43.07 U4.7 | U1.14 34.79,75.75 32.78,73.74 v32.78,55.09
  Bottom 0.305: v32.78,55.09 v32.78,48.78
STEP2  (via drill 0.35)
  Top 0.305: v48.98,60.85 v48.98,58.63 | v51.2,44.81 55.8,44.81 57.44,43.18 v57.44,40.05 | v58.02,32.43 61.34,32.43 61.8,31.97 83.09,31.97 83.74,31.32 U3.7 | U1.13 42.57,77.02 v43.5,77.95
  Bottom 0.305: v48.98,58.63 48.98,55.45 48.5,54.98 48.5,47.51 v51.2,44.81 | v57.44,40.05 57.44,33.02 v58.02,32.43 | v43.5,77.95 44.13,77.31 44.13,70.64 45.72,69.06 48.26,69.06 48.98,68.34 v48.98,60.85
STEP3  (via drill 0.35)
  Top 0.305: v50.09,60.85 v50.09,58.63 | v51.21,46.09 55.8,46.09 58.98,42.91 v58.98,40.05 | v50.09,78.31 50.72,78.94 52.22,78.94 52.88,78.28 U1.27
  Bottom 0.305: v50.09,78.31 v50.09,60.85 | v50.09,58.63 50.09,55.11 49.5,54.53 49.5,47.79 v51.21,46.09 | v58.98,40.05 58.98,17.51 63.74,12.75 82.31,12.75 83.74,11.32 U5.7
STEP4  (via drill 0.35)
  Top 0.305: v53.58,58.78 53.58,59.1 55.58,61.1 55.6,61.12 56.2,61.72 56.2,81.6 55.7,82.09 U1.30 | v50.72,24.34 33.74,24.34 32.94,23.54 U6.7
  Bottom 0.305: v53.58,58.78 53.58,56.06 52.04,54.53 52.04,44.75 53.74,43.05 53.74,32.26 51.83,30.35 51.83,25.29 50.88,24.34 v50.72,24.34
TXD  (via drill 0.35)
  Top 0.305: R8.2 v30.24,91.49 | U1.35 51.86,88.44 v50.72,89.58
  Bottom 0.305: v30.24,91.49 40.56,91.49 42.47,89.58 v50.72,89.58
VBUS
  Top 0.305: 74.53,92 J1.1
  Top 0.406: C6.2 80.69,82.91 D3.C 84.66,79.86 85.17,80.38 85.17,89.11 84.38,89.9 79.58,89.9 79.3,89.62 C7.2 75.61,88.31 | 75.17,88.31 74.53,88.95 74.53,92 | 75.17,88.31 75.17,87.68 74.53,87.04 R12.2 | 75.25,87.95 75.61,88.31 | 75.61,88.31 75.17,88.31
VCC  (via drill 0.35)  (4 unrouted)
  Top 0.305: R5.1
  Top 0.406: 54.09,10.65 C10.+ | 54.53,32.91 C11.+
  Top 0.61: C11.+ 54.53,33.23 | C13.+ | 62.79,4.97 62.79,6.24 62.79,6.56 | LTZPDGND.P$1 26.43,4.02 23.42,7.03 19.93,7.03 18.34,8.62 R11.1 18.34,33.73 19.37,34.77 19.37,38.39 18.66,39.1 R5.1
  Top 1.27: U4.16 48.18,31.96 49.45,33.23 C11.+ 54.33,33.34 55.88,33.34 56.44,32.78 v56.44,31 | U3.16 68.5,40.21 67.87,39.58 C13.+ | U6.16 48.18,11.48 48.82,12.12 C10.+ 54.09,5.96 | C13.+ 60.41,37.2 v60.41,34.97 | v56.91,25.61 56.91,20.68 56.28,20.05 56.28,6.71 | v60.41,20.84 58.18,18.62 58.18,11.64 59.77,10.05 59.77,6.56 | 59.77,6.56 59.77,5.13 | 56.28,6.71 56.28,4.33 | 56.28,6.71 55.33,5.76 | 56.28,6.71 57.23,5.76 | 59.77,6.56 58.98,5.76 | 59.77,6.56 60.56,5.76 | 62.15,5.92 62.79,6.56 C12.+ 66.16,11.95 68.5,14.29 U5.16 | 62.79,6.24 63.42,5.6
  Top 4.572: LTZPDGND.P$1 62.79,4.02
  Bottom 1.27: v56.44,31 56.44,26.08 v56.91,25.61 | v60.41,34.97 v60.41,20.84